# Altium schematic sheet inductor_recieve.SchDoc
size A4
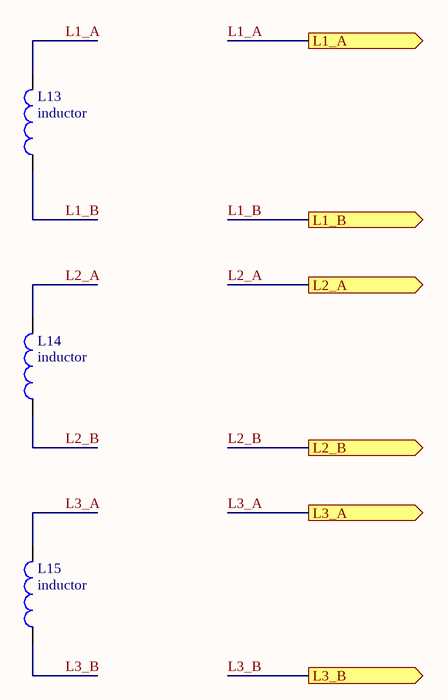
[diagram p0: inductor_recieve.SchDoc]

## Parts
L13  inductor  [inductor]
L14  inductor  [inductor]
L15  inductor  [inductor]

## Ports
L1_A (out), L1_B (out), L2_A (out), L2_B (out), L3_A (out), L3_B (out)

## Nets
L1_A: L13.2 ; port L1_A
L1_B: L13.1 ; port L1_B
L2_A: L14.2 ; port L2_A
L2_B: L14.1 ; port L2_B
L3_A: L15.2 ; port L3_A
L3_B: L15.1 ; port L3_B